# EAGLE schematic BT60 (EAGLE 9.6.2)
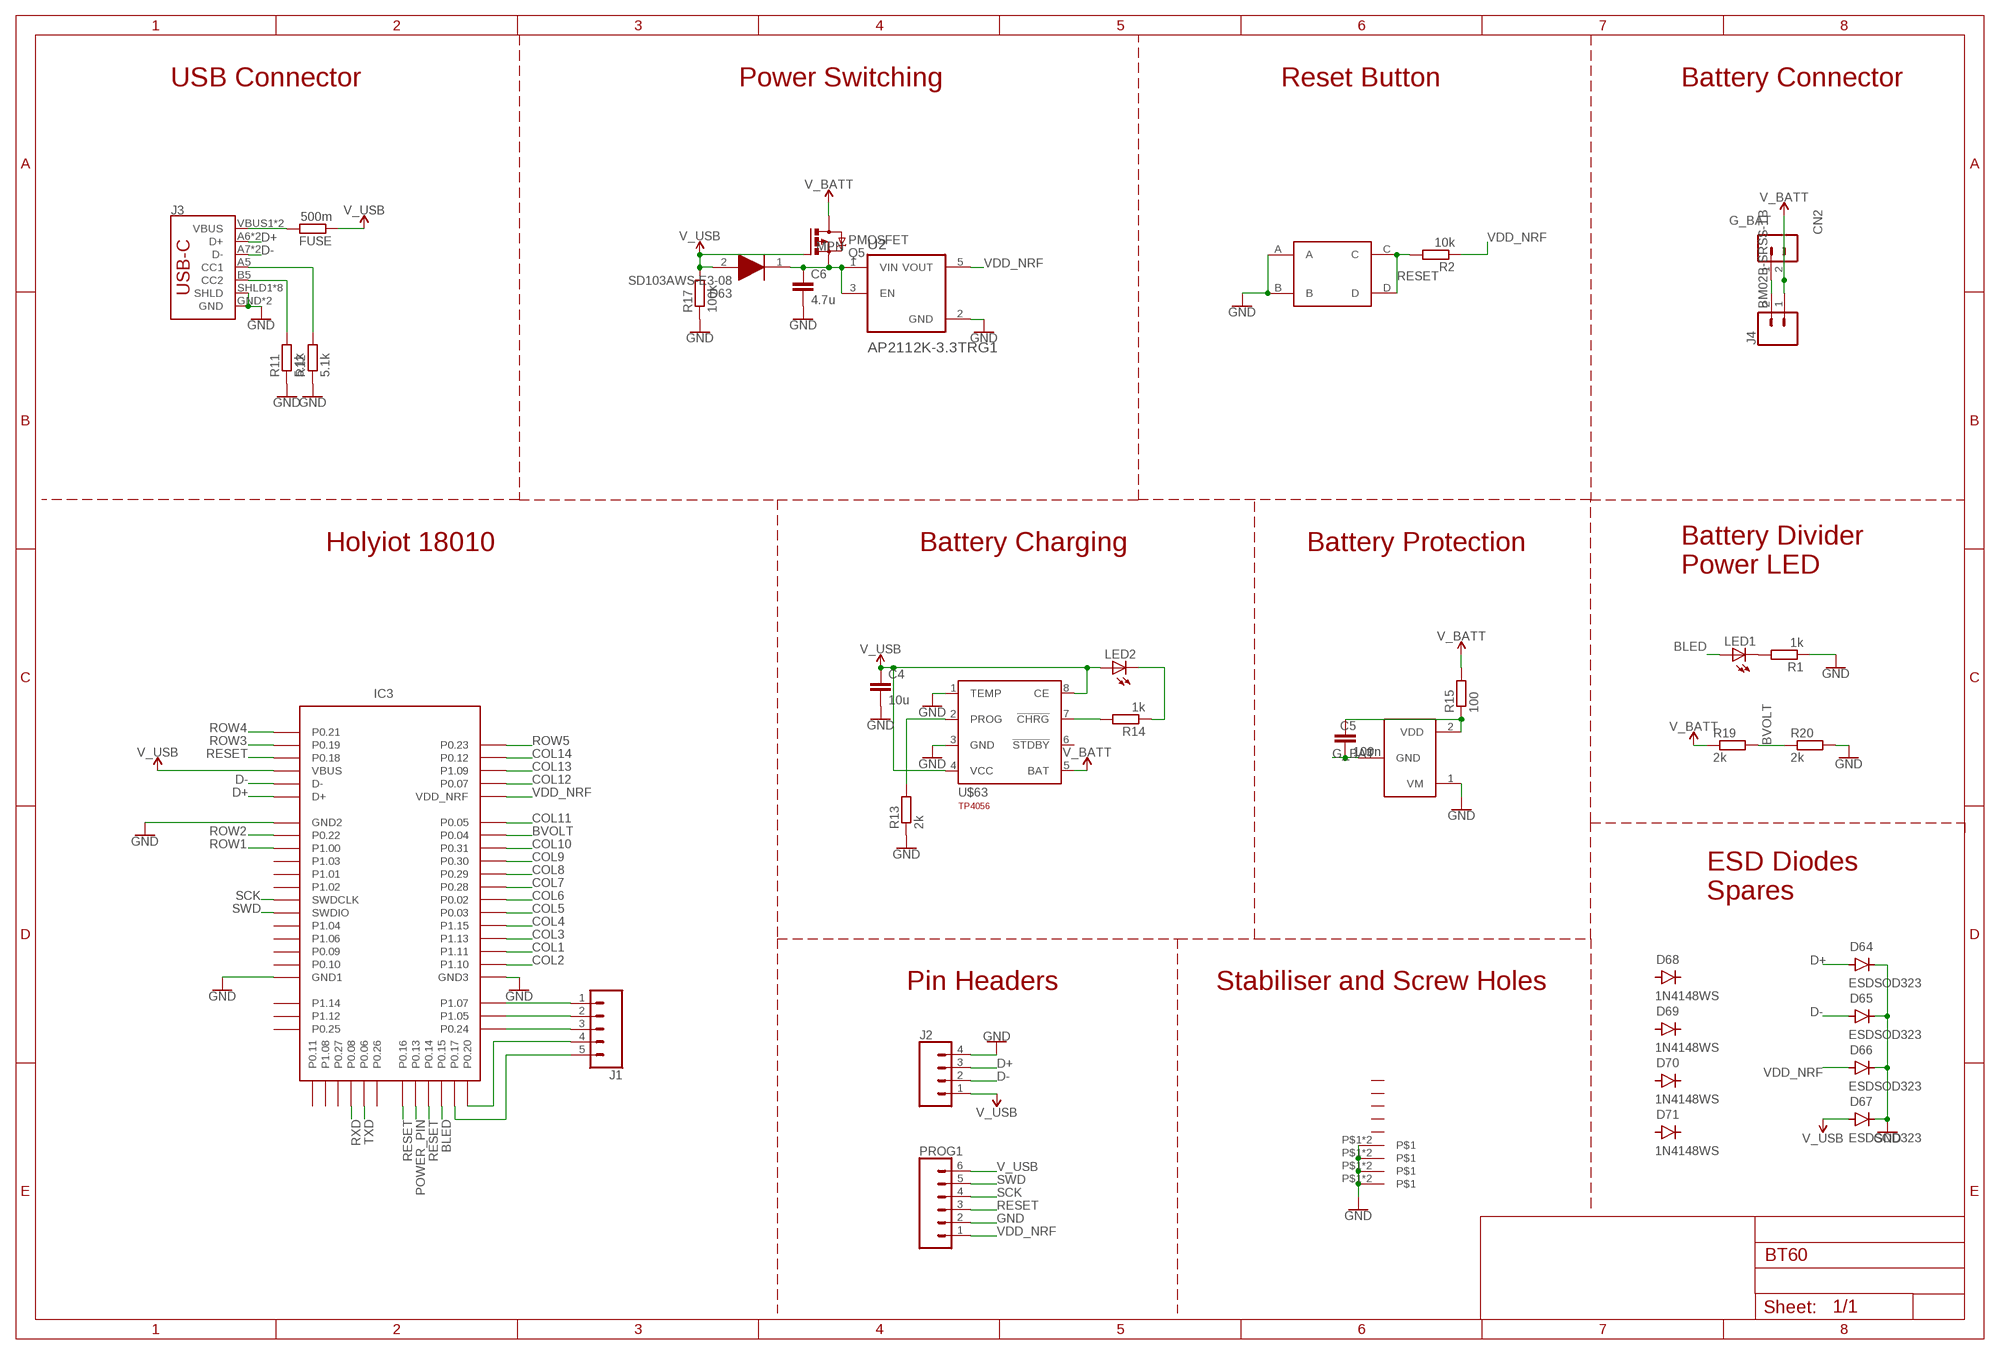
[diagram p0: schematic, sheet 1, part 1 of 2]
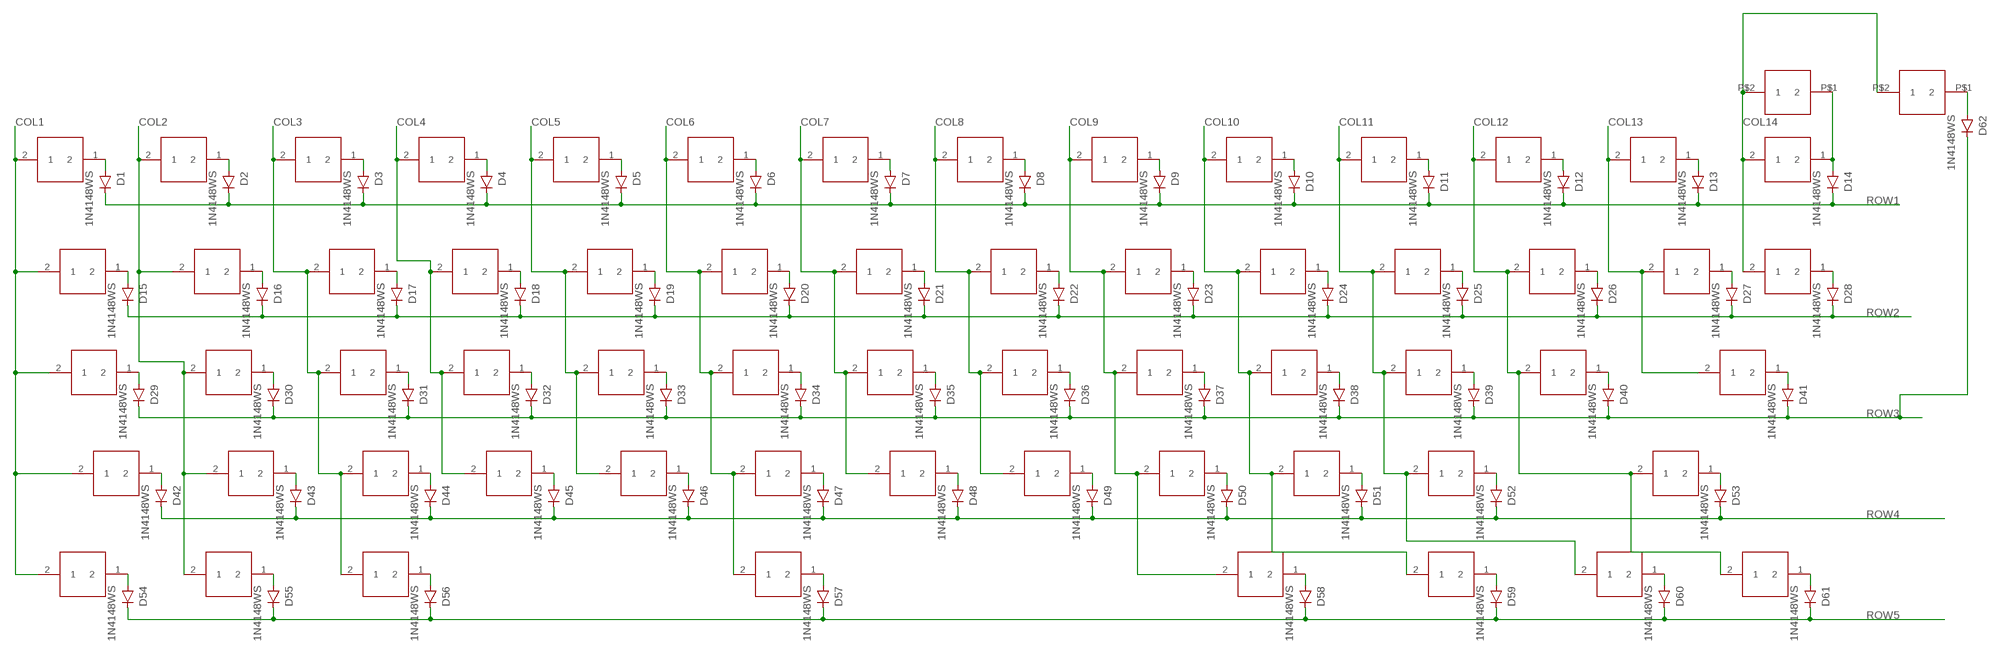
[diagram p1: schematic, sheet 1, part 2 of 2]

## Parts
C4  10u  C-EUC0603  [C0603]
C5  100n  C-EUC0603  [C0603]
C6  4.7u  C-EUC0603  [C0603]
CN2  BM02B-SRSS-TB  [BM02B-SRSS-TB]
D1  1N4148WS  [SOD-323]
D2  1N4148WS  [SOD-323]
D3  1N4148WS  [SOD-323]
D4  1N4148WS  [SOD-323]
D5  1N4148WS  [SOD-323]
D6  1N4148WS  [SOD-323]
D7  1N4148WS  [SOD-323]
D8  1N4148WS  [SOD-323]
D9  1N4148WS  [SOD-323]
D10  1N4148WS  [SOD-323]
D11  1N4148WS  [SOD-323]
D12  1N4148WS  [SOD-323]
D13  1N4148WS  [SOD-323]
D14  1N4148WS  [SOD-323]
D15  1N4148WS  [SOD-323]
D16  1N4148WS  [SOD-323]
D17  1N4148WS  [SOD-323]
D18  1N4148WS  [SOD-323]
D19  1N4148WS  [SOD-323]
D20  1N4148WS  [SOD-323]
D21  1N4148WS  [SOD-323]
D22  1N4148WS  [SOD-323]
D23  1N4148WS  [SOD-323]
D24  1N4148WS  [SOD-323]
D25  1N4148WS  [SOD-323]
D26  1N4148WS  [SOD-323]
D27  1N4148WS  [SOD-323]
D28  1N4148WS  [SOD-323]
D29  1N4148WS  [SOD-323]
D30  1N4148WS  [SOD-323]
D31  1N4148WS  [SOD-323]
D32  1N4148WS  [SOD-323]
D33  1N4148WS  [SOD-323]
D34  1N4148WS  [SOD-323]
D35  1N4148WS  [SOD-323]
D36  1N4148WS  [SOD-323]
D37  1N4148WS  [SOD-323]
D38  1N4148WS  [SOD-323]
D39  1N4148WS  [SOD-323]
D40  1N4148WS  [SOD-323]
D41  1N4148WS  [SOD-323]
D42  1N4148WS  [SOD-323]
D43  1N4148WS  [SOD-323]
D44  1N4148WS  [SOD-323]
D45  1N4148WS  [SOD-323]
D46  1N4148WS  [SOD-323]
D47  1N4148WS  [SOD-323]
D48  1N4148WS  [SOD-323]
D49  1N4148WS  [SOD-323]
D50  1N4148WS  [SOD-323]
D51  1N4148WS  [SOD-323]
D52  1N4148WS  [SOD-323]
D53  1N4148WS  [SOD-323]
D54  1N4148WS  [SOD-323]
D55  1N4148WS  [SOD-323]
D56  1N4148WS  [SOD-323]
D57  1N4148WS  [SOD-323]
D58  1N4148WS  [SOD-323]
D59  1N4148WS  [SOD-323]
D60  1N4148WS  [SOD-323]
D61  1N4148WS  [SOD-323]
D62  1N4148WS  [SOD-323]
D63  SD103AWS-E3-08  [SOD2713X115N]
D64  ESDSOD323  [SOD-323]
D65  ESDSOD323  [SOD-323]
D66  ESDSOD323  [SOD-323]
D67  ESDSOD323  [SOD-323]
D68  1N4148WS  [SOD-323]
D69  1N4148WS  [SOD-323]
D70  1N4148WS  [SOD-323]
D71  1N4148WS  [SOD-323]
FUSE  500m  R-EU_R0603  [R0603]
IC1  XB3303ASOT23  [SOT23-3]
IC3  HOLYIOT_18010  [PCBCOMPONENT_1]
J1  CONN_051.27MM  [1X05_1.27MM]
J2  CONN_041X04_NO_SILK  [1X04_NO_SILK]
J3  SPARKFUN-CONNECTORS_USB_C16PIN  [SPARKFUN-CONNECTORS_USB-C-16P]
J4  CONN_02  [1X02]
LED1  LEDCHIPLED_0805  [CHIPLED_0805]
LED2  LEDCHIPLED_0805  [CHIPLED_0805]
PROG1  CONN_06NO_SILK_FEMALE_PTH  [1X06_NO_SILK]
Q5  PMOSFET  PMOSFET_SOT23  [SOT23]
R1  1k  R-EU_R0603  [R0603]
R2  10k  R-EU_R0603  [R0603]
R11  5.1k  R-EU_R0603  [R0603]
R12  5.1k  R-EU_R0603  [R0603]
R13  2k  R-EU_R0603  [R0603]
R14  1k  R-EU_R0603  [R0603]
R15  100  R-EU_R0603  [R0603]
R17  100k  R-EU_R0603  [R0603]
R19  2k  R-EU_R0603  [R0603]
R20  2k  R-EU_R0603  [R0603]
U2  AP2112K-3.3TRG1  [SOT95P285X140-5N]
U$1  CHERRY  [CHERRY]
U$2  CHERRY  [CHERRY]
U$3  CHERRY  [CHERRY]
U$4  CHERRY  [CHERRY]
U$5  CHERRY  [CHERRY]
U$6  CHERRY  [CHERRY]
U$7  CHERRY  [CHERRY]
U$8  CHERRY  [CHERRY]
U$9  CHERRY  [CHERRY]
U$10  CHERRY  [CHERRY]
U$11  CHERRY  [CHERRY]
U$12  CHERRY  [CHERRY]
U$13  CHERRY  [CHERRY]
U$14  CHERRY_CORNER_OFFED  [CHERRY_CORNER_OFFED]
U$15  CHERRY  [CHERRY]
U$16  CHERRY  [CHERRY]
U$17  CHERRY  [CHERRY]
U$18  CHERRY  [CHERRY]
U$19  CHERRY  [CHERRY]
U$20  CHERRY  [CHERRY]
U$21  CHERRY  [CHERRY]
U$22  CHERRY  [CHERRY]
U$23  CHERRY  [CHERRY]
U$24  CHERRY  [CHERRY]
U$25  CHERRY  [CHERRY]
U$26  CHERRY  [CHERRY]
U$27  CHERRY  [CHERRY]
U$28  CHERRY_CORNER_OFFED  [CHERRY_CORNER_OFFED]
U$29  CHERRY  [CHERRY]
U$30  CHERRY  [CHERRY]
U$31  CHERRY  [CHERRY]
U$32  CHERRY  [CHERRY]
U$33  CHERRY  [CHERRY]
U$34  CHERRY  [CHERRY]
U$35  CHERRY_CORNER_OFFED  [CHERRY_CORNER_OFFED]
U$36  CHERRY  [CHERRY]
U$37  CHERRY  [CHERRY]
U$38  CHERRY  [CHERRY]
U$39  CHERRY  [CHERRY]
U$40  CHERRY  [CHERRY]
U$41  CHERRY  [CHERRY]
U$42  CHERRY  [CHERRY]
U$43  CHERRY  [CHERRY]
U$44  CHERRY  [CHERRY]
U$45  CHERRY  [CHERRY]
U$46  CHERRY  [CHERRY]
U$47  CHERRY  [CHERRY]
U$48  CHERRY  [CHERRY]
U$49  CHERRY  [CHERRY]
U$50  CHERRY  [CHERRY]
U$51  CHERRY  [CHERRY]
U$52  CHERRY  [CHERRY]
U$53  CHERRY  [CHERRY]
U$54  CHERRY  [CHERRY]
U$55  CHERRY  [CHERRY]
U$56  CHERRY  [CHERRY]
U$57  CHERRY  [CHERRY]
U$58  CHERRY  [CHERRY]
U$59  CHERRY  [CHERRY]
U$60  CHERRY  [CHERRY]
U$61  CHERRY  [CHERRY]
U$62  SMD-BUTTON  [SMD-BUTTON]
U$63  TP4056SOI8  [SOIC8]
U$64  2.5MM_ELONGATED  [2.5MM_ELONGATED]
U$65  2.5MM_ELONGATED  [2.5MM_ELONGATED]
U$66  2.5MM_HOLE  [2.5MM_HOLE]
U$67  2.5MM_ELONGATED  [2.5MM_ELONGATED]
U$68  STAB-2U  [STAB-2U]
U$69  STAB-2U  [STAB-2U]
U$70  STAB-2U  [STAB-2U]
U$71  STAB-2U  [STAB-2U]
U$72  STAB-6U  [STAB-6.25U]
U$73  CHERRY-SOLDER  [CHERRY-SOLDER]
U$74  CHERRY-SOLDER  [CHERRY-SOLDER]

## Nets
BLED: IC3.P0.15 LED1.A
BVOLT: IC3.P0.04 R19.2 R20.1
COL1: IC3.P1.11 U$1.2 U$15.2 U$29.2 U$42.2 U$54.2
COL2: IC3.P1.10 U$2.2 U$16.2 U$30.2 U$43.2 U$55.2
COL3: IC3.P1.13 U$3.2 U$17.2 U$31.2 U$44.2 U$56.2
COL4: IC3.P1.15 U$4.2 U$18.2 U$32.2 U$45.2
COL5: IC3.P0.03 U$5.2 U$19.2 U$33.2 U$46.2
COL6: IC3.P0.02 U$6.2 U$20.2 U$34.2 U$47.2 U$57.2
COL7: IC3.P0.28 U$7.2 U$21.2 U$35.2 U$48.2
COL8: IC3.P0.29 U$8.2 U$22.2 U$36.2 U$49.2
COL9: IC3.P0.30 U$9.2 U$23.2 U$37.2 U$50.2 U$58.2
COL10: IC3.P0.31 U$10.2 U$24.2 U$38.2 U$51.2 U$59.2
COL11: IC3.P0.05 U$11.2 U$25.2 U$39.2 U$52.2 U$60.2
COL12: IC3.P0.07 U$12.2 U$26.2 U$40.2 U$53.2 U$61.2
COL13: IC3.P1.09 U$13.2 U$27.2 U$41.2
COL14: IC3.P0.12 U$14.2 U$28.2 U$73.P$2 U$74.P$2
D+: D64.A IC3.D+ J2.3 J3.A6(D+) J3.B6(D+)
D-: D65.A IC3.D- J2.2 J3.A7(D-) J3.B7(D-)
G_BAT: C5.2 CN2.1 IC1.3(GND) J4.2
GND: C4.2 C6.2 D64.C D65.C D66.C D67.C IC1.1(VM) IC3.GND1(GND2) IC3.GND2(GND3) IC3.GND(GND1) J2.4 J3.GND J3.GND2(GND) J3.SHLD1(SHLD) J3.SHLD2(SHLD) J3.SHLD3(SHLD) J3.SHLD4(SHLD) J3.SHLD5(SHLD) J3.SHLD6(SHLD) J3.SHLD7(SHLD) J3.SHLD8(SHLD) PROG1.2 R1.1 R11.1 R12.1 R13.1 R17.1 R20.2 U2.2(GND) U$62.A U$62.B U$63.1(TEMP) U$63.3(GND) U$64.P$1 U$64.P$2 U$65.P$1 U$65.P$2 U$66.P$1 U$66.P$2 U$67.P$1 U$67.P$2
N$1: D1.A U$1.1
N$2: LED1.C R1.2
N$3: D14.A U$14.1 U$73.P$1
N$4: D13.A U$13.1
N$5: D12.A U$12.1
N$6: D11.A U$11.1
N$7: D10.A U$10.1
N$8: D9.A U$9.1
N$9: D8.A U$8.1
N$10: D7.A U$7.1
N$11: D6.A U$6.1
N$12: D5.A U$5.1
N$13: D4.A U$4.1
N$14: D3.A U$3.1
N$15: D2.A U$2.1
N$16: D15.A U$15.1
N$17: IC3.P1.07 J1.1
N$18: D28.A U$28.1
N$19: D27.A U$27.1
N$20: D26.A U$26.1
N$21: D25.A U$25.1
N$22: D24.A U$24.1
N$23: D23.A U$23.1
N$24: D22.A U$22.1
N$25: D21.A U$21.1
N$26: D20.A U$20.1
N$27: D19.A U$19.1
N$28: D18.A U$18.1
N$29: D17.A U$17.1
N$30: D16.A U$16.1
N$31: D29.A U$29.1
N$32: IC3.P1.05 J1.2
N$33: D41.A U$41.1
N$34: D40.A U$40.1
N$35: D39.A U$39.1
N$36: D38.A U$38.1
N$37: D37.A U$37.1
N$38: D36.A U$36.1
N$39: D35.A U$35.1
N$40: D34.A U$34.1
N$41: D33.A U$33.1
N$42: D32.A U$32.1
N$43: D31.A U$31.1
N$44: D30.A U$30.1
N$45: D42.A U$42.1
N$46: IC3.P0.24 J1.3
N$47: D53.A U$53.1
N$48: D52.A U$52.1
N$49: D51.A U$51.1
N$50: D50.A U$50.1
N$51: D49.A U$49.1
N$52: D48.A U$48.1
N$53: D47.A U$47.1
N$54: D46.A U$46.1
N$55: D45.A U$45.1
N$56: D44.A U$44.1
N$57: D43.A U$43.1
N$58: D54.A U$54.1
N$59: IC3.P0.20 J1.4
N$60: D61.A U$61.1
N$61: D60.A U$60.1
N$62: D59.A U$59.1
N$63: D58.A U$58.1
N$64: D57.A U$57.1
N$65: D56.A U$56.1
N$66: D55.A U$55.1
N$67: IC3.P0.17 J1.5
N$68: D62.A U$74.P$1
N$69: C5.1 IC1.2(VDD) R15.1
N$70: FUSE.2 J3.VBUS1(VBUS) J3.VBUS2(VBUS)
N$72: J3.B5(CC2) R11.2
N$73: J3.A5(CC1) R12.2
N$74: R13.2 U$63.2(PROG)
N$75: LED2.C R14.1
N$76: R14.2 U$63.7(!CHRG)
N$81: C6.1 D63.1(K) Q5.2(S) U2.1(VIN) U2.3(EN)
POWER_PIN: IC3.P0.13
RESET: IC3.P0.14 IC3.P0.16 IC3.P0.18 PROG1.3 R2.2 U$62.C U$62.D
ROW1: D1.C D2.C D3.C D4.C D5.C D6.C D7.C D8.C D9.C D10.C D11.C D12.C D13.C D14.C IC3.P1.00
ROW2: D15.C D16.C D17.C D18.C D19.C D20.C D21.C D22.C D23.C D24.C D25.C D26.C D27.C D28.C IC3.P0.22
ROW3: D29.C D30.C D31.C D32.C D33.C D34.C D35.C D36.C D37.C D38.C D39.C D40.C D41.C D62.C IC3.P0.19
ROW4: D42.C D43.C D44.C D45.C D46.C D47.C D48.C D49.C D50.C D51.C D52.C D53.C IC3.P0.21
ROW5: D54.C D55.C D56.C D57.C D58.C D59.C D60.C D61.C IC3.P0.23
RXD: IC3.P0.08
SCK: IC3.SWDCLK PROG1.4
SWD: IC3.SWDIO PROG1.5
TXD: IC3.P0.06
V_BATT: CN2.2 J4.1 Q5.3(D) R15.2 R19.1 U$63.5(BAT)
V_USB: C4.1 D63.2(A) D67.A FUSE.1 IC3.VBUS J2.1 LED2.A PROG1.6 Q5.1(G) R17.2 U$63.4(VCC) U$63.8(CE)
VDD_NRF: D66.A IC3.VDD_NRF PROG1.1 R2.1 U2.5(VOUT)
Unconnected: D68.A D68.C D69.A D69.C D70.A D70.C D71.A D71.C IC3.P0.09 IC3.P0.10 IC3.P0.11 IC3.P0.25 IC3.P0.26 IC3.P0.27 IC3.P1.01 IC3.P1.02 IC3.P1.03 IC3.P1.04 IC3.P1.06 IC3.P1.08 IC3.P1.12 IC3.P1.14 U$63.6(!STDBY)

## Notes on the sheet
- USB Connector | Power Switching | Reset Button | Battery Connector
- Holyiot 18010 | Battery Charging | Battery Protection
- Battery Divider
  Power LED
- ESD Diodes
  Spares
- Pin Headers | Stabiliser and Screw Holes

## Library data of the parts
C4-C6 = resistor:C-EU: CAPACITOR, European symbol
CN2 = con-jst-sh:BM02B-SRSS: JST SH series header 1.00mm pitch disconnectable crimp style connectors, vertical (side entry type), 2 pins
D1-D62 D68-D71 = Diodes:1N4148WS: DIODE GEN PURP 75V 150MA SOD323F Manufacturer's datasheet <https://www.onsemi.com/pub/Collateral/1N914BWS-D.pdf>; CREATED_BY: PCBLayout.com; DIGIKEY_PART_NUMBER: 1N4148WSFSTR-ND; MANUFACTURER: Diodes Incorporated; MPN: 1N4148WS; PACKAGE: SOD-323
D63 = SD103AWS-E3-08:SD103AWS-E3-08: Vishay SD103AWS-E3-08, SMT Schottky Diode, 40V 350mA, 10ns, 2-Pin SOD-323 Source: Datasheet <http://www.vishay.com/docs/85682/sd103aws.pdf>; ARROW_PART_NUMBER: SD103AWS-E3-08; ARROW_PRICE-STOCK: https://www.arrow.com/en/products/sd103aws-e3-08/vishay; DESCRIPTION: Vishay SD103AWS-E3-08, SMT Schottky Diode, 40V 350mA, 10ns, 2-Pin SOD-323; HEIGHT: 1.15mm; MANUFACTURER_NAME: Vishay; MANUFACTURER_PART_NUMBER: SD103AWS-E3-08; MOUSER_PART_NUMBER: 78-SD103AWS-E3-08; MOUSER_PRICE-STOCK: https://www.mouser.co.uk/ProductDetail/Vishay-Semiconductors/SD103AWS-E3-08?qs=S660mHfF5o1xcba7ic5A%252BA%3D%3D
D64-D67 = Volume_V1:ESDSOD323: DIODE GEN PURP 75V 150MA SOD323F Manufacturer's datasheet <https://www.onsemi.com/pub/Collateral/1N914BWS-D.pdf>; CREATED_BY: PCBLayout.com; MANUFACTURER: Diodes Incorporated; PACKAGE: SOD-323
FUSE R1 R2 R11-R15 R17 R19 R20 = rcl:R-EU_: RESISTOR, European symbol; SPICEPREFIX: R
IC1 = Volume_V1:XB3303A
IC3 = HOLYIOT-18010-VER1.0-0.8MM:HOLYIOT_18010
J1 = SparkFun-Connectors:CONN_05: Multi connection point. Often used as Generic Header-pin footprint for 0.1 inch spaced/style header connections On any of the 0.1 inch spaced packages, you can populate with these: Break Away Headers - Straight <https://www.sparkfun.com/products/116> (PRT-00116) Break Away Male Headers - Right Angle <https://www.sparkfun.com/products/553> (PRT-00553) Female Headers <https://www.sparkfun.com/products/115> (PRT-00115) Break Away Headers - Machine Pin <https://www.sparkfun.com/products/117> (PRT-00117) Break Away Female Headers - Swiss Machine Pin <https://www.sparkfun.com/products/743> (PRT-00743) For SCREWTERMINALS and SPRING TERMINALS visit here: Screw Terimnals on SparkFun.com <https://www.sparkfun.com/search/results?term=Screw+Terminals> (5mm/3.5mm/2.54mm spacing) This device is also useful as a general connection point to wire up your design to another part of your project. Our various solder wires solder well into these plated through hole pads. Hook-Up Wire - Assortment (Stranded, 22 AWG) <https://www.sparkfun.com/products/11375> (PRT-11375) Hook-Up Wire - Assortment (Solid Core, 22 AWG) <https://www.sparkfun.com/products/11367> (PRT-11367) View the entire wire category on our website here <https://www.sparkfun.com/categories/141> Special notes: Molex polarized connector foot print use with SKU : PRT-08231 with associated crimp pins and housings. 1MM SMD Version SKU: PRT-10208
J2 = SparkFun-Connectors:CONN_04: Multi connection point. Often used as Generic Header-pin footprint for 0.1 inch spaced/style header connections On any of the 0.1 inch spaced packages, you can populate with these: Break Away Headers - Straight <https://www.sparkfun.com/products/116> (PRT-00116) Break Away Male Headers - Right Angle <https://www.sparkfun.com/products/553> (PRT-00553) Female Headers <https://www.sparkfun.com/products/115> (PRT-00115) Break Away Headers - Machine Pin <https://www.sparkfun.com/products/117> (PRT-00117) Break Away Female Headers - Swiss Machine Pin <https://www.sparkfun.com/products/743> (PRT-00743) For SCREWTERMINALS and SPRING TERMINALS visit here: Screw Terimnals on SparkFun.com <https://www.sparkfun.com/search/results?term=Screw+Terminals> (5mm/3.5mm/2.54mm spacing) This device is also useful as a general connection point to wire up your design to another part of your project. Our various solder wires solder well into these plated through hole pads. Hook-Up Wire - Assortment (Stranded, 22 AWG) <https://www.sparkfun.com/products/11375> (PRT-11375) Hook-Up Wire - Assortment (Solid Core, 22 AWG) <https://www.sparkfun.com/products/11367> (PRT-11367) View the entire wire category on our website here <https://www.sparkfun.com/categories/141> Special notes: Molex polarized connector foot print use with SKU : PRT-08231 with associated crimp pins and housings. 1MM SMD Version SKU: PRT-10208; PROD_ID: CONN-09696
J3 = USB-C-Breakout:SPARKFUN-CONNECTORS_USB_C: USB Type C 16Pin Connector Super Speed pins not available on the 16-pin purely SMD connector so this part is best for USB 2.0 implementations. D1 and D2 are tied together enabling D+/- no matter which way the cable is plugged into the connector. The two channel configuration pins (CC1/2) are exposed. These are normally connected to ground via 5.1k resistors but can be reconfigured for high current/high power applications.; PROD_ID: CONN-14122
J4 = SparkFun-Connectors:CONN_02: Multi connection point. Often used as Generic Header-pin footprint for 0.1 inch spaced/style header connections On any of the 0.1 inch spaced packages, you can populate with these: Break Away Headers - Straight <https://www.sparkfun.com/products/116> (PRT-00116) Break Away Male Headers - Right Angle <https://www.sparkfun.com/products/553> (PRT-00553) Female Headers <https://www.sparkfun.com/products/115> (PRT-00115) Break Away Headers - Machine Pin <https://www.sparkfun.com/products/117> (PRT-00117) Break Away Female Headers - Swiss Machine Pin <https://www.sparkfun.com/products/743> (PRT-00743) For SCREWTERMINALS and SPRING TERMINALS visit here: Screw Terimnals on SparkFun.com <https://www.sparkfun.com/search/results?term=Screw+Terminals> (5mm/3.5mm/2.54mm spacing) This device is also useful as a general connection point to wire up your design to another part of your project. Our various solder wires solder well into these plated through hole pads. Hook-Up Wire - Assortment (Stranded, 22 AWG) <https://www.sparkfun.com/products/11375> (PRT-11375) Hook-Up Wire - Assortment (Solid Core, 22 AWG) <https://www.sparkfun.com/products/11367> (PRT-11367) View the entire wire category on our website here <https://www.sparkfun.com/categories/141> Special notes: Molex polarized connector foot print use with: PRT-08233 with associated crimp pins and housings. 2.54_SCREWTERM for use with PRT-10571. 3.5mm Screw Terminal footprints for PRT-08084 5mm Screw Terminal footprints for use with PRT-08432
LED1 LED2 = adafruit:LED: LED OSRAM: - CHIPLED LG R971, LG N971, LY N971, LG Q971, LY Q971, LO R971, LY R971 LH N974, LH R974 LS Q976, LO Q976, LY Q976 LO Q996 - Hyper CHIPLED LW Q18S LB Q993, LB Q99A, LB R99A - SideLED LS A670, LO A670, LY A670, LG A670, LP A670 LB A673, LV A673, LT A673, LW A673 LH A674 LY A675 LS A676, LA A676, LO A676, LY A676, LW A676 LS A679, LY A679, LG A679 - Hyper Micro SIDELED® LS Y876, LA Y876, LO Y876, LY Y876 LT Y87S - SmartLED LW L88C, LW L88S LB L89C, LB L89S, LG L890 LS L89K, LO L89K, LY L89K LS L896, LA L896, LO L896, LY L896 - TOPLED LS T670, LO T670, LY T670, LG T670, LP T670 LSG T670, LSP T670, LSY T670, LOP T670, LYG T670 LG T671, LOG T671, LSG T671 LB T673, LV T673, LT T673, LW T673 LH T674 LS T676, LA T676, LO T676, LY T676, LB T676, LH T676, LSB T676, LW T676 LB T67C, LV T67C, LT T67C, LS T67K, LO T67K, LY T67K, LW E67C LS E67B, LA E67B, LO E67B, LY E67B, LB E67C, LV E67C, LT E67C LW T67C LS T679, LY T679, LG T679 LS T770, LO T770, LY T770, LG T770, LP T770 LB T773, LV T773, LT T773, LW T773 LH T774 LS E675, LA E675, LY E675, LS T675 LS T776, LA T776, LO T776, LY T776, LB T776 LHGB T686 LT T68C, LB T68C - Hyper Mini TOPLED® LB M676 - Mini TOPLED Santana® LG M470 LS M47K, LO M47K, LY M47K Source: http://www.osram.convergy.de/
PROG1 = SparkFun-Connectors:CONN_06: Multi connection point. Often used as Generic Header-pin footprint for 0.1 inch spaced/style header connections On any of the 0.1 inch spaced packages, you can populate with these: Break Away Headers - Straight <https://www.sparkfun.com/products/116> (PRT-00116) Break Away Male Headers - Right Angle <https://www.sparkfun.com/products/553> (PRT-00553) Female Headers <https://www.sparkfun.com/products/115> (PRT-00115) Break Away Headers - Machine Pin <https://www.sparkfun.com/products/117> (PRT-00117) Break Away Female Headers - Swiss Machine Pin <https://www.sparkfun.com/products/743> (PRT-00743) Arduino Stackable Header - 6 Pin <https://www.sparkfun.com/products/9280> (PRT-09280) For SCREWTERMINALS and SPRING TERMINALS visit here: Screw Terimnals on SparkFun.com <https://www.sparkfun.com/search/results?term=Screw+Terminals> (5mm/3.5mm/2.54mm spacing) This device is also useful as a general connection point to wire up your design to another part of your project. Our various solder wires solder well into these plated through hole pads. Hook-Up Wire - Assortment (Stranded, 22 AWG) <https://www.sparkfun.com/products/11375> (PRT-11375) Hook-Up Wire - Assortment (Solid Core, 22 AWG) <https://www.sparkfun.com/products/11367> (PRT-11367) View the entire wire category on our website here <https://www.sparkfun.com/categories/141>; PROD_ID: CONN-08437
Q5 = Transistor:PMOSFET: P-Channel MOSFET - Generic; CATEGORY: Transistor; MPN: SL2301S; SUB-CATEGORY: MOSFET; TYPE: P-Channel
U2 = AP2112K-3.3TRG1:AP2112K-3.3TRG1: AP2112 Series 0.6 A 3.3 V Fixed Output SMT LDO Linear Regulator - SOT23-5 Check prices <https://pricing.snapeda.com/parts/AP2112K-3.3TRG1/Diodes%20Inc./view-part?ref=eda>; AVAILABILITY: Good; DESCRIPTION: Linear Voltage Regulator IC 1 Output 600mA SOT-25; MF: Diodes Inc.; MP: AP2112K-3.3TRG1; PACKAGE: SOT-753 Diodes Inc.; PRICE: None; PURCHASE-URL: https://pricing.snapeda.com/search/part/AP2112K-3.3TRG1/?ref=eda
U$1-U$13 U$15-U$27 U$29-U$34 U$36-U$61 = Volume_V1:CHERRY
U$14 U$28 U$35 = Volume_V1:CHERRY_CORNER_OFFED
U$62 = Volume_V1:SMD-BUTTON
U$63 = TP4056:TP4056: TP4056 Data sheet <http://goo.gl/J7k8TF> Dave.Calaway Eagle Library <https://goo.gl/Muy1Tr>
U$64 U$65 U$67 = Volume_V1:2.5MM_ELONGATED
U$66 = Volume_V1:2.5MM_HOLE
U$68-U$71 = Volume_V1:STAB-2U
U$72 = Volume_V1:STAB-6U
U$73 U$74 = Volume_V1:CHERRY-SOLDER